# Altium project YellowBeanSprout.PrjPCB
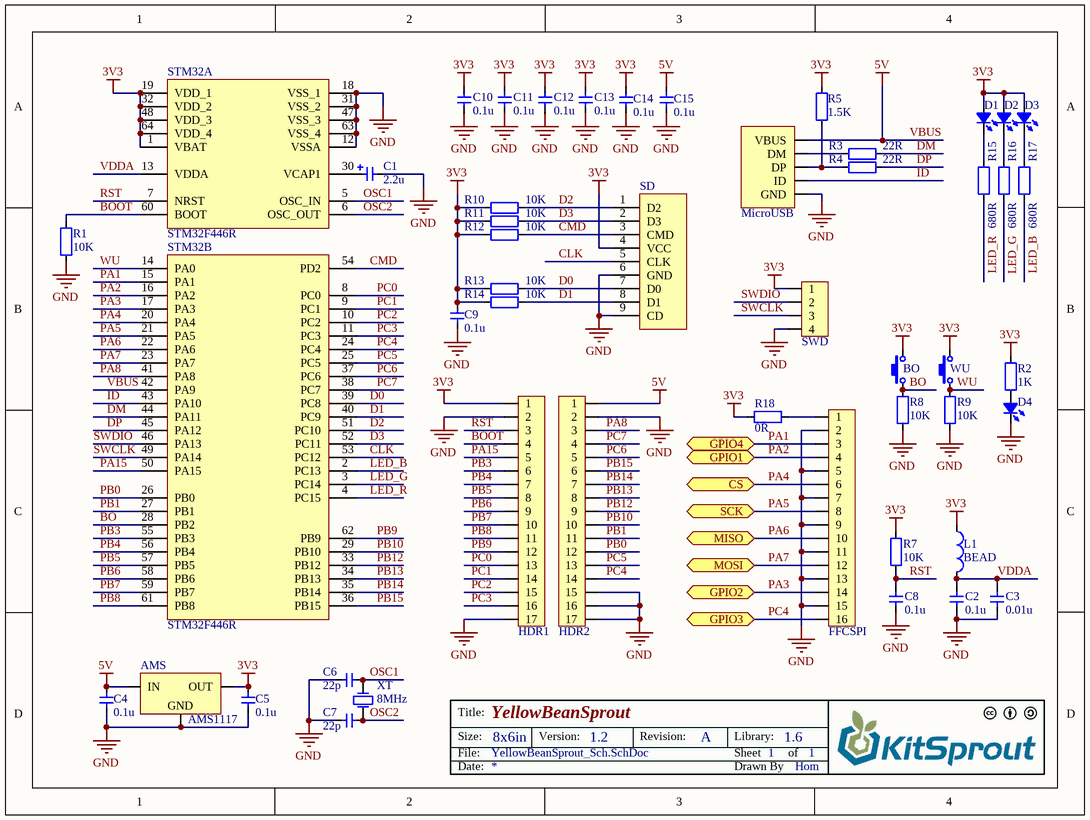
[diagram p0: YellowBeanSprout_Sch.SchDoc]
1 sheet, 48 parts. Net scope: flat (ports and power ports of the same name join across sheets).
Board file: YellowBeanSprout_Pcb.PcbDoc

## Sheet YellowBeanSprout_Sch.SchDoc: YellowBeanSprout
size 203 x 152 mm; Author: Hom; CompanyName: KitSprout; DrawnBy: Hom; Engineer: Hom; Organization: KitSprout; Revision: A; SheetNumber: 1; SheetTotal: 1; License: CC BY-SA 4.0; Version: 1.2; LibVersion: 1.6; PageSetup: Record=PageOptions|CenterHorizontal=True|CenterVertical=True|PrintScale=0.48|XCorrection=1.00|YCorrection=1.00|PrintKind=0|BorderSize=5000000|LeftOffset=0|BottomOffset=0|Orientation=2|PaperLength=1000|PaperWidth=1000|Scale=100|PaperSource=7|PrintQuality=-3|MediaType=1|DitherType=10|PrintScaleMode=1|PaperKind=A4|PaperIndex=9

### Parts
AMS  AMS1117  [SOT223-3]
BO  ButtonTACT_3x6x2.5_180  [ButtonTACT_3x6x2.5_180]  (value not drawn)
C1  value 2.2u  [CAP_TAN_P0805]  (hidden comment: Cap_Tan_0805)
C2  value 0.1u  [CAP_0603]  (hidden comment: Cap_0603)
C3  value 0.01u  [CAP_0603]  (hidden comment: Cap_0603)
C4  value 0.1u  [CAP_0603]  (hidden comment: Cap_0603)
C5  value 0.1u  [CAP_0603]  (hidden comment: Cap_0603)
C6  value 22p  [CAP_0603]  (hidden comment: Cap_0603)
C7  value 22p  [CAP_0603]  (hidden comment: Cap_0603)
C8  value 0.1u  [CAP_0603]  (hidden comment: Cap_0603)
C9  value 0.1u  [CAP_0603]  (hidden comment: Cap_0603)
C10  value 0.1u  [CAP_0603]  (hidden comment: Cap_0603)
C11  value 0.1u  [CAP_0603]  (hidden comment: Cap_0603)
C12  value 0.1u  [CAP_0603]  (hidden comment: Cap_0603)
C13  value 0.1u  [CAP_0603]  (hidden comment: Cap_0603)
C14  value 0.1u  [CAP_0603]  (hidden comment: Cap_0603)
C15  value 0.1u  [CAP_0603]  (hidden comment: Cap_0603)
D1  LED_0603  [LED_0603_RED]  (value not drawn)
D2  LED_0603  [LED_0603_GREEN]  (value not drawn)
D3  LED_0603  [LED_0603_BLUE]  (value not drawn)
D4  LED_0805  [LED_0805_YELLOW]  (value not drawn)
FFCSPI  FFC_0.5_16  [FFC_0.5_16]  (value not drawn)
HDR1  HDR1x17_2.54  [HDR1X17_2.54_180]  (value not drawn)
HDR2  HDR1x17_2.54T  [HDR1X17_2.54_180]  (value not drawn)
L1  value BEAD  [IND_0603]  (hidden comment: Ind_0603)
MicroUSB  USB_Micro  [USB_Micro-AB]  (value not drawn)
R1  value 10K  [RES_0603]  (hidden comment: Res_0603)
R2  value 1K  [RES_0603]  (hidden comment: Res_0603)
R3  value 22R  [RES_0603]  (hidden comment: Res_0603)
R4  value 22R  [RES_0603]  (hidden comment: Res_0603)
R5  value 1.5K  [RES_0603]  (hidden comment: Res_0603)
R7  value 10K  [RES_0603]  (hidden comment: Res_0603)
R8  value 10K  [RES_0603]  (hidden comment: Res_0603)
R9  value 10K  [RES_0603]  (hidden comment: Res_0603)
R10  value 10K  [RES_0603]  (hidden comment: Res_0603)
R11  value 10K  [RES_0603]  (hidden comment: Res_0603)
R12  value 10K  [RES_0603]  (hidden comment: Res_0603)
R13  value 10K  [RES_0603]  (hidden comment: Res_0603)
R14  value 10K  [RES_0603]  (hidden comment: Res_0603)
R15  value 680R  [RES_0603]  (hidden comment: Res_0603)
R16  value 680R  [RES_0603]  (hidden comment: Res_0603)
R17  value 680R  [RES_0603]  (hidden comment: Res_0603)
R18  value 0R  [RES_0603]  (hidden comment: Res_0603)
SD  SD_Card_TF  [SD_Card_TF]  (value not drawn)
STM32  STM32F446R  [LQFP_P0.5_64]  (parts A,B of 2)
SWD  HDR1x4_2.54  [HDR1X4_2.54_90F]  (value not drawn)
WU  ButtonTACT_3x6x2.5_180  [ButtonTACT_3x6x2.5_180]  (value not drawn)
XT  value 8MHz  [XT_5032_2]  (hidden comment: XTAL_5032_2P)

### Ports
CS, GPIO1, GPIO2, GPIO3, GPIO4, MISO, MOSI, SCK

### Nets
3V3: AMS.2(OUT) BO.2 C5.1 C9.1 C10.2 C11.2 C12.2 C13.2 C14.1 D1.1(A) D2.1(A) D3.1(A) HDR1.1 L1.1 R2.2 R5.1 R7.2 R10.2 R11.2 R12.2 R13.2 R14.2 R18.2 SD.4(VCC) STM32.1(VBAT) STM32.19(VDD_1) STM32.32(VDD_2) STM32.48(VDD_3) STM32.64(VDD_4) SWD.1 WU.2
GND: AMS.1(GND) C1.2 C2.1 C3.1 C4.2 C5.2 C6.2 C7.2 C8.1 C9.2 C10.1 C11.1 C12.1 C13.1 C14.2 C15.2 D4.2(K) FFCSPI.2 FFCSPI.5 FFCSPI.7 FFCSPI.9 FFCSPI.11 FFCSPI.13 FFCSPI.15 HDR1.2 HDR1.17 HDR2.2 HDR2.15 HDR2.16 HDR2.17 MicroUSB.5(GND) R1.1 R8.1 R9.1 SD.6(GND) SD.9(CD) STM32.12(VSSA) STM32.18(VSS_1) STM32.31(VSS_2) STM32.47(VSS_3) STM32.63(VSS_4) SWD.4
VBUS: AMS.3(IN) C4.1 C15.1 HDR2.1 MicroUSB.1(VBUS) STM32.42(PA9)  [also labelled 5V]
BO: BO.1 R8.2 STM32.28(PB2)
BOOT: HDR1.4 R1.2 STM32.60(BOOT)
CLK: SD.5(CLK) STM32.53(PC12)
CMD: R12.1 SD.3(CMD) STM32.54(PD2)
D0: R13.1 SD.7(D0) STM32.39(PC8)
D1: R14.1 SD.8(D1) STM32.40(PC9)
D2: R10.1 SD.1(D2) STM32.51(PC10)
D3: R11.1 SD.2(D3) STM32.52(PC11)
DM: R3.1 STM32.44(PA11)
DP: R4.1 STM32.45(PA12)
ID: MicroUSB.4(ID) STM32.43(PA10)
LED_B: R17.1 STM32.2(PC13)
LED_G: R16.1 STM32.3(PC14)
LED_R: R15.1 STM32.4(PC15)
OSC1: C6.1 STM32.5(OSC_IN) XT.2(OSC2)
OSC2: C7.1 STM32.6(OSC_OUT) XT.1(OSC1)
PA1: FFCSPI.3 STM32.15(PA1) ; port GPIO4
PA2: FFCSPI.4 STM32.16(PA2) ; port GPIO1
PA3: FFCSPI.14 STM32.17(PA3) ; port GPIO2
PA4: FFCSPI.6 STM32.20(PA4) ; port CS
PA5: FFCSPI.8 STM32.21(PA5) ; port SCK
PA6: FFCSPI.10 STM32.22(PA6) ; port MISO
PA7: FFCSPI.12 STM32.23(PA7) ; port MOSI
PA8: HDR2.3 STM32.41(PA8)
PA15: HDR1.5 STM32.50(PA15)
PB0: HDR2.12 STM32.26(PB0)
PB1: HDR2.11 STM32.27(PB1)
PB3: HDR1.6 STM32.55(PB3)
PB4: HDR1.7 STM32.56(PB4)
PB5: HDR1.8 STM32.57(PB5)
PB6: HDR1.9 STM32.58(PB6)
PB7: HDR1.10 STM32.59(PB7)
PB8: HDR1.11 STM32.61(PB8)
PB9: HDR1.12 STM32.62(PB9)
PB10: HDR2.10 STM32.29(PB10)
PB12: HDR2.9 STM32.33(PB12)
PB13: HDR2.8 STM32.34(PB13)
PB14: HDR2.7 STM32.35(PB14)
PB15: HDR2.6 STM32.36(PB15)
PC0: HDR1.13 STM32.8(PC0)
PC1: HDR1.14 STM32.9(PC1)
PC2: HDR1.15 STM32.10(PC2)
PC3: HDR1.16 STM32.11(PC3)
PC4: FFCSPI.16 HDR2.14 STM32.24(PC4) ; port GPIO3
PC5: HDR2.13 STM32.25(PC5)
PC6: HDR2.5 STM32.37(PC6)
PC7: HDR2.4 STM32.38(PC7)
RST: C8.2 HDR1.3 R7.1 STM32.7(NRST)
SWCLK: STM32.49(PA14) SWD.3
SWDIO: STM32.46(PA13) SWD.2
VDDA: C2.2 C3.2 L1.2 STM32.13(VDDA)
WU: R9.2 STM32.14(PA0) WU.1
NetC1_1: C1.1 STM32.30(VCAP1)
NetD1_2: D1.2(K) R15.2
NetD2_2: D2.2(K) R16.2
NetD3_2: D3.2(K) R17.2
NetD4_1: D4.1(A) R2.1
NetFFCSPI_1: FFCSPI.1 R18.1
NetMicroUSB_2: MicroUSB.2(DM) R3.2
NetMicroUSB_3: MicroUSB.3(DP) R4.2 R5.2

### Notes on the sheet
- Title:
- Size:
- Date:
- File:
- 8x6in
- Version:
- Revision:
- Sheet
- Drawn By
- Library:
- of

### Library data of the parts
AMS = AMS1117: Power
BO WU = ButtonTACT_3x6x2.5_180: Button
C1 = Cap_Tan_0805: Capacitor
C2-C15 = Cap_0603: Capacitor
D1-D3 = LED_0603: LED
D4 = LED_0805: LED
FFCSPI = FFC_0.5_16: FFC
HDR1 = HDR1x17_2.54: Header
HDR2 = HDR1x17_2.54T: Header
L1 = Ind_0603: Inductor
MicroUSB = USB_Micro: USB
R1-R5 R7-R18 = Res_0603: Resistor
SD = SD_Card_TF: SD
STM32 = STM32F446R: MCU
SWD = HDR1x4_2.54: Header
XT = XTAL_5032_2P: Crystal Oscillator